# Altium schematic sheet USB_HUB.SchDoc
size 594 x 420 mm; SheetNumber: 14; SheetTotal: 20
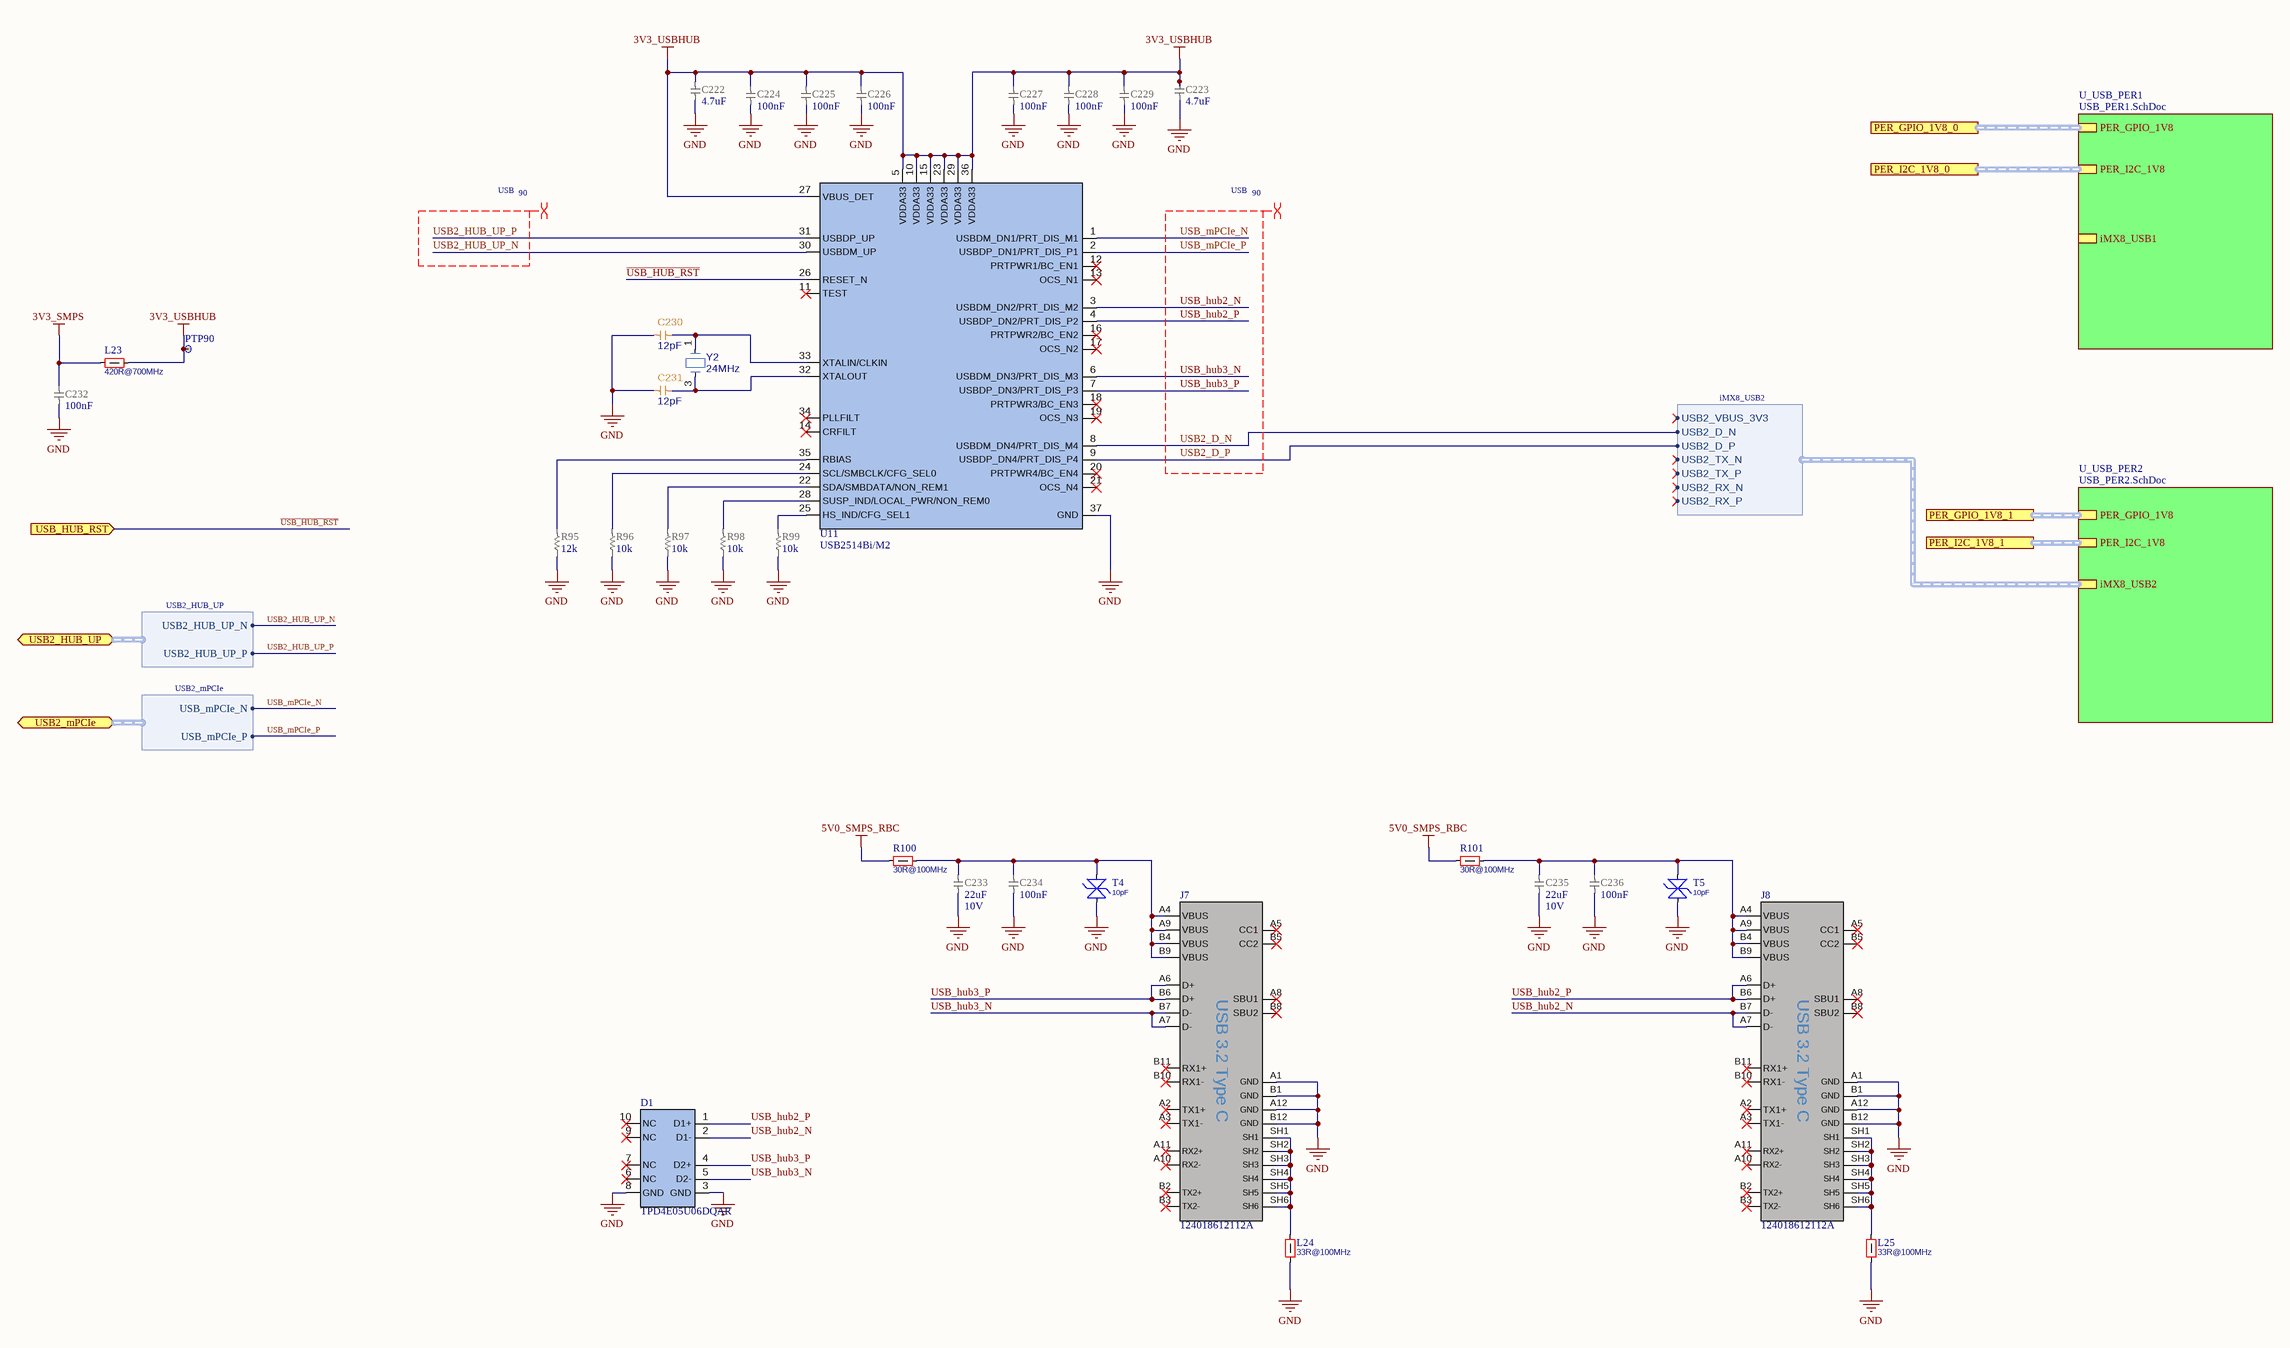
[diagram p0: USB_HUB.SchDoc]

## Parts
C222  value 4.7uF  [CAP_0402_H09W07_UN1Q]  (hidden comment: CAP_0402_4u7_10V_X6S)
C223  value 4.7uF  [CAP_0402_H09W07_UN1Q]  (hidden comment: CAP_0402_4u7_10V_X6S)
C224  value 100nF  [CAP_0201_UN1Q]  (hidden comment: CAP_0201_100n_X7S_16V)
C225  value 100nF  [CAP_0201_UN1Q]  (hidden comment: CAP_0201_100n_X7S_16V)
C226  value 100nF  [CAP_0201_UN1Q]  (hidden comment: CAP_0201_100n_X7S_16V)
C227  value 100nF  [CAP_0201_UN1Q]  (hidden comment: CAP_0201_100n_X7S_16V)
C228  value 100nF  [CAP_0201_UN1Q]  (hidden comment: CAP_0201_100n_X7S_16V)
C229  value 100nF  [CAP_0201_UN1Q]  (hidden comment: CAP_0201_100n_X7S_16V)
C230  value 12pF  [CAP_0201_UN1Q]  (hidden comment: CAP_0201_12pF_RF_MATCHING)
C231  value 12pF  [CAP_0201_UN1Q]  (hidden comment: CAP_0201_12pF_RF_MATCHING)
C232  value 100nF  [CAP_0201_UN1Q]  (hidden comment: CAP_0201_100n_X7S_16V)
C233  value 22uF  Voltage: 10V  [CAP_0805_UN1Q]  (hidden comment: CAP_0805_22uF_10V_X7R)
C234  value 100nF  [CAP_0201_UN1Q]  (hidden comment: CAP_0201_100n_X7S_16V)
C235  value 22uF  Voltage: 10V  [CAP_0805_UN1Q]  (hidden comment: CAP_0805_22uF_10V_X7R)
C236  value 100nF  [CAP_0201_UN1Q]  (hidden comment: CAP_0201_100n_X7S_16V)
D1  TPD4E05U06DQAR  [USON10_DQA_TI]
J7  Part Number: 124018612112A  [USB_C_AMPHENOL_124018612112A]  (hidden comment: USB_C_AMPHENOL_124018612112A)
J8  Part Number: 124018612112A  [USB_C_AMPHENOL_124018612112A]  (hidden comment: USB_C_AMPHENOL_124018612112A)
L23  value 420R@700MHz  [IND_0201_UN1Q]  (hidden comment: FERRITE_0201_BLF_700MHz_420Ohm)
L24  value 33R@100MHz  [IND_0201_UN1Q]  (hidden comment: FERRITE_0201_BLM03_33Ohm)
L25  value 33R@100MHz  [IND_0201_UN1Q]  (hidden comment: FERRITE_0201_BLM03_33Ohm)
PTP90  PTP_0.4mm  [PTP_0.4mm]  (value not drawn)  (no BOM)
R95  value 12k  [RES_0201_UN1Q]  (hidden comment: RES_0201_12k)
R96  value 10k  [RES_0201_UN1Q]  (hidden comment: RES_0201_10k)
R97  value 10k  [RES_0201_UN1Q]  (hidden comment: RES_0201_10k)
R98  value 10k  [RES_0201_UN1Q]  (hidden comment: RES_0201_10k)
R99  value 10k  [RES_0201_UN1Q]  (hidden comment: RES_0201_10k)
R100  value 30R@100MHz  [FERR_BLM15KD]  (hidden comment: FERRITE_0402_BLM15KD)
R101  value 30R@100MHz  [FERR_BLM15KD]  (hidden comment: FERRITE_0402_BLM15KD)
T4  value 10pF  [TVS_0201_EZAEG]  (hidden comment: TVS_0201_10pF)
T5  value 10pF  [TVS_0201_EZAEG]  (hidden comment: TVS_0201_10pF)
U11  Part Number: USB2514Bi/M2  [USB251xB_QFN36P50_600X600X100]  (hidden comment: USB2514Bi_M2)
Y2  value 24MHz  [XTAL_3225_EPSON]  (hidden comment: XTAL_24M_10ppm_9pF_+105C)

## Sub-sheets
U_USB_PER1 = USB_PER1.SchDoc: PER_GPIO_1V8 (harness PER_GPIO_1V8_0), iMX8_USB1 (harness iMX8_USB1), PER_I2C_1V8 (harness PER_I2C_1V8_0)
U_USB_PER2 = USB_PER2.SchDoc: PER_GPIO_1V8 (harness PER_GPIO_1V8_1), PER_I2C_1V8 (harness PER_I2C_1V8_1), iMX8_USB2 (harness iMX8_USB2)

## Ports
PER_GPIO_1V8_0 (harness PER_GPIO_1V8_0), PER_GPIO_1V8_1 (harness PER_GPIO_1V8_1), PER_I2C_1V8_0 (harness PER_GPIO_1V8_0), PER_I2C_1V8_1 (harness PER_GPIO_1V8_1), USB2_HUB_UP (bidir, harness USB2_HUB_UP), USB2_mPCIe (bidir, harness USB2_mPCIe), USB_HUB_RST (in)

## Harnesses
USB2_HUB_UP: USB2_HUB_UP_P, USB2_HUB_UP_N
USB2_mPCIe: USB_mPCIe_N, USB_mPCIe_P
iMX8_USB2: USB2_VBUS_3V3, USB2_D_N, USB2_D_P, USB2_TX_N, USB2_TX_P, USB2_RX_N, USB2_RX_P

## Nets
3V3_SMPS: C232.2 L23.1
3V3_USBHUB: C222.2 C223.2 C224.1 C225.1 C226.1 C227.1 C228.1 C229.1 L23.2 PTP90.1(TP) U11.5(VDDA33) U11.10(VDDA33) U11.15(VDDA33) U11.23(VDDA33) U11.27(VBUS_DET) U11.29(VDDA33) U11.36(VDDA33)
5V0_SMPS_RBC: R100.1 R101.1
GND: C222.1 C223.1 C224.2 C225.2 C226.2 C227.2 C228.2 C229.2 C230.1 C231.1 C232.1 C233.1 C234.1 C235.1 C236.1 D1.3(GND) D1.8(GND) J7.A1(GND) J7.A12(GND) J7.B1(GND) J7.B12(GND) J8.A1(GND) J8.A12(GND) J8.B1(GND) J8.B12(GND) L24.2 L25.2 R95.1 R96.1 R97.1 R98.1 R99.1 T4.1 T5.1 U11.37(GND) Y2.2(GND) Y2.4(GND)
~{USB_HUB_RST}: U11.26(RESET_N) ; port USB_HUB_RST
USB2_D_N: U11.8(USBDM_DN4/PRT_DIS_M4) ; sheet U_USB_PER2/iMX8_USB2.USB2_D_N
USB2_D_P: U11.9(USBDP_DN4/PRT_DIS_P4) ; sheet U_USB_PER2/iMX8_USB2.USB2_D_P
USB2_HUB_UP_N: U11.30(USBDM_UP) ; port USB2_HUB_UP.USB2_HUB_UP_N
USB2_HUB_UP_P: U11.31(USBDP_UP) ; port USB2_HUB_UP.USB2_HUB_UP_P
USB_hub2_N: D1.2(D1-) J8.A7(D-) J8.B7(D-) U11.3(USBDM_DN2/PRT_DIS_M2)
USB_hub2_P: D1.1(D1+) J8.A6(D+) J8.B6(D+) U11.4(USBDP_DN2/PRT_DIS_P2)
USB_hub3_N: D1.5(D2-) J7.A7(D-) J7.B7(D-) U11.6(USBDM_DN3/PRT_DIS_M3)
USB_hub3_P: D1.4(D2+) J7.A6(D+) J7.B6(D+) U11.7(USBDP_DN3/PRT_DIS_P3)
USB_mPCIe_N: U11.1(USBDM_DN1/PRT_DIS_M1) ; port USB2_mPCIe.USB_mPCIe_N
USB_mPCIe_P: U11.2(USBDP_DN1/PRT_DIS_P1) ; port USB2_mPCIe.USB_mPCIe_P
NetC230_2: C230.2 U11.33(XTALIN/CLKIN) Y2.1
NetC231_2: C231.2 U11.32(XTALOUT) Y2.3
NetC233_2: C233.2 C234.2 J7.A4(VBUS) J7.A9(VBUS) J7.B4(VBUS) J7.B9(VBUS) R100.2 T4.2
NetC235_2: C235.2 C236.2 J8.A4(VBUS) J8.A9(VBUS) J8.B4(VBUS) J8.B9(VBUS) R101.2 T5.2
NetJ7_SH1: J7.SH1 J7.SH2 J7.SH3 J7.SH4 J7.SH5 J7.SH6 L24.1
NetJ8_SH1: J8.SH1 J8.SH2 J8.SH3 J8.SH4 J8.SH5 J8.SH6 L25.1
NetR95_2: R95.2 U11.35(RBIAS)
NetR96_2: R96.2 U11.24(SCL/SMBCLK/CFG_SEL0)
NetR97_2: R97.2 U11.22(SDA/SMBDATA/NON_REM1)
NetR98_2: R98.2 U11.28(SUSP_IND/LOCAL_PWR/NON_REM0)
NetR99_2: R99.2 U11.25(HS_IND/CFG_SEL1)

Not connected (* = marked no-connect by the designer): D1 6(NC)* 7(NC)* 9(NC)* 10(NC)*; J7 A2(TX1+)* A3(TX1-)* A5(CC1)* A8(SBU1)* A10(RX2-)* A11(RX2+)* B2(TX2+)* B3(TX2-)* B5(CC2)* B8(SBU2)* B10(RX1-)* B11(RX1+)*; J8 A2(TX1+)* A3(TX1-)* A5(CC1)* A8(SBU1)* A10(RX2-)* A11(RX2+)* B2(TX2+)* B3(TX2-)* B5(CC2)* B8(SBU2)* B10(RX1-)* B11(RX1+)*; U11 11(TEST)* 12(PRTPWR1/BC_EN1)* 13(OCS_N1)* 14(CRFILT)* 16(PRTPWR2/BC_EN2)* 17(OCS_N2)* 18(PRTPWR3/BC_EN3)* 19(OCS_N3)* 20(PRTPWR4/BC_EN4)* 21(OCS_N4)* 34(PLLFILT)*

## Buses and harness runs
harness port PER_GPIO_1V8_0 = sheet U_USB_PER1/PER_GPIO_1V8
harness port PER_GPIO_1V8_1 = sheet U_USB_PER2/PER_GPIO_1V8
harness port PER_I2C_1V8_0 = sheet U_USB_PER1/PER_I2C_1V8
harness port PER_I2C_1V8_1 = sheet U_USB_PER2/PER_I2C_1V8

## Layout directives
differential pair; differential pair class 90; net class USB; rule Matched Net Lengths [Tolerance = 0.3mm]: USB2_D_N, USB2_D_P, USB2_HUB_UP_N, USB2_HUB_UP_P, USB_hub2_N, USB_hub2_P, USB_hub3_N, USB_hub3_P, USB_mPCIe_N, USB_mPCIe_P

## Notes on the sheet
- DWG NO:
- REV:
- THIS DOCUMENT AND THE DATA DISCLOSED HEREIN OR
- HEREWITH IS THE PROPERTY OF ALTIUM LIMITED AND MAY
- BE FREELY DISTRIBUTED IN WHOLE. NO RIGHTS ARE
- RESERVED OR EXPRESS OR IMPLIED WARANTEE GIVEN.
- REVISION
- DESCRIPTION
- DATE
- APPROVED
- ENG:
- APPROVALS
- PROJECT
- DSN:
- CHK:
- REFERENCE DOCUMENTS
- PROJECT REVISION:
- TITLE
- DOCUMENT REVISION:
- DESIGN ITEM:
- BOM:
- FAB DWG:
- PCB DWG:
- ASSY DWG:
- SCALE:
- A2
- SIZE
- CAGE CODE
- FILE NAME
- DWG NO.
- SHEET
- OF
- REV
- (in symbol CMP-001-001438-8) USB 3.2 Type C

## Library data of the parts
C222 C223 = CMP-001-000888-12: CAP; Part Number: GRT155C81A475ME13J; Manufacturer: Murata; Sort order: 304; HasBeenBuilt: TBD; Alternative component: Allowed; System: RLC; Voltage: 10V; Temperature characteristics: X6S; Tolerance: +/-10%; ComponentLink2Description: 2_Product page; Package: 0402; Creation date: 26042024; ComponentLink1Description: 1_Datasheet; ComponentLink3Description: 3_X-information; ComponentLink4Description: 4_X-information; Manufacturer Part Number: GRT155C81A475ME13J; Component Type: Capacitor
C224-C229 C232 C234 C236 = CMP-001-000385-16: CAP; Part Number: GRM033C71C104KE14D; Manufacturer: Murata; Temperature characteristics: X7S; Tolerance: +/-10%; Sort order: 302; HasBeenBuilt: TBD; Alternative component: Allowed; Voltage: 16V; System: RLC; Package: 0201; ClassName: SMALL; ComponentLink1Description: 1_Datasheet; ComponentLink2Description: 2_Product page; ComponentLink3Description: 3_X-information; ComponentLink4Description: 4_X-information; Creation date: 20190101; Source: RLC_UN1Q.SchLib; Manufacturer Part Number: GRM033C71C104KE14D; Component Type: Capacitor
C230 C231 = CMP-001-000420-11: CAP_RF_MATCHING; Part Number: GRM0335C1H120GA01; Manufacturer: Murata; Voltage: 50V; Tolerance: +/- 2%; Temperature characteristics: C0G; Remark: RF matching, use part number; Sort order: 202; HasBeenBuilt: TBD; System: RLC; Package: 0201; Operating temperature range: -55 ... +125C; ComponentLink1Description: 1_Datasheet; ComponentLink2Description: 2_Product page; ComponentLink3Description: 3_X-information; ComponentLink4Description: 4_X-information; Creation date: 20211123; ClassName: SMALL; Source: RLC_UN1Q.SchLib; Manufacturer Part Number: GRM0335C1H120GA01; Component Type: Capacitor
C233 C235 = CMP-001-000892-11: CAP; Part Number: GRM21BZ71A226ME15L; Manufacturer: Murata; Tolerance: +/-20%; Alternative component: Allowed; Sort order: 308; Temperature characteristics: X7R; System: RLC; HasBeenBuilt: TBD; Creation date: 22032024; ComponentLink4Description: 4_X-information; ComponentLink1Description: 1_Datasheet; ComponentLink3Description: 3_X-information; ComponentLink2Description: 2_Product page; Package: 0805; Manufacturer Part Number: GRM21BZ71A226ME15L; Component Type: Capacitor
D1 = CMP-001-000916-4: 4-CH Low-Capacitance ESD Diode; Manufacturer: Texas Instruments; HasBeenBuilt: Saluki3_HW_RIB_2; Sort order: 405; System: IC; ComponentLink1Description: 1_Datasheet; ComponentLink1URL: http://www.ti.com/lit/gpn/tpd4e05u06; ComponentLink2Description: 2_Product page; ComponentLink2URL: https://www.ti.com/product/TPD4E05U06; ComponentLink3Description: 3_X-information; ComponentLink4Description: 4_X-information; Creation date: 20210927; Dimensions WxLxH: 2.5x1.0x0.55; Operating temperature range: -40... +125 °C; Package: USON10; Part Number: TPD4E05U06DQAR; ECCN: EAR99; RoHS: RoHS3; Source: UUDET_KOMPONENTIT.SchLib; Manufacturer Part Number: TPD4E05U06DQAR; Component Type: ESD & EMI
J7 J8 = CMP-001-001438-8: USB3.2 GEN1, Type C, Top mount, CH 1.50mm, Dual Row SMT, IPX8; Manufacturer Part Number: 12402082E512A; Sort order: 101; System: Connector; ClassName: BIG; ComponentLink1Description: 1_Datasheet; ComponentLink1URL: https://cdn.amphenol-cs.com/media/wysiwyg/files/documentation/datasheet/inputoutput/io_usb_type_c.pdf; ComponentLink2Description: 2_Product page; ComponentLink2URL: https://www.amphenol-cs.com/product/124018612112a.html; ComponentLink3Description: 3_X-information; ComponentLink4Description: 4_X-information; Operating temperature range: -40C to +85C; Creation date: 20250617; Manufacturer: Amphenol; ECCN: EAR99; Design Item ID: USB_C_AMPHENOL_124018612112A; RoHS: RoHS 3; Component Type: Interface Connector
L23 = CMP-001-000747-7: FERRITE; Part Number: BLF03JD421GZE; Manufacturer: Murata; HasBeenBuilt: False; System: Discrete; Sort order: 362; Tolerance: 25%; ComponentLink3Description: 3_X-information; Creation date: 20200304; ClassName: SMALL; ComponentLink1Description: 1_Datasheet; ComponentLink2Description: 2_Product page; Package: 0201; ComponentLink4Description: 4_X-information; Source: Discrete_UN1Q.SchLib; Operating temperature range: -55 ... +125C; Manufacturer Part Number: BLF03JD421GZE; Component Type: Ferrite
L24 L25 = CMP-001-000744-7: FERRITE; Manufacturer: Murata; Part Number: BLM03PG330SN1; Tolerance: 25%; Sort order: 362; HasBeenBuilt: TBD; System: Discrete; Package: 0201; Operating temperature range: -55 ... +125C; ClassName: SMALL; ComponentLink1Description: 1_Datasheet; ComponentLink1URL: https://www.murata.com/en-us/products/productdetail.aspx?cate=luNoiseSupprFilteChipFerriBead&partno=BLM03PG330SN1%23; ComponentLink2Description: 2_Product page; ComponentLink3Description: 3_X-information; ComponentLink4Description: 4_X-information; Creation date: 20200304; Source: Discrete_UN1Q.SchLib; Manufacturer Part Number: BLM03PG330SN1; Component Type: Ferrite
PTP90 = CMP-001-001296-3: Production Testpoint 0.4mm. Flying probe. Use 1mm pitch.; ComponentLink4Description: 4_X-information; ComponentLink1Description: 1_Datasheet; Part Number: PTP 0.4mm; Sort order: -; ClassName: SMALL; System: Test Point; HasBeenBuilt: -; Design Item ID: PTP_0.4mm; ComponentLink3Description: 3_X-information; Creation date: 20240909; ComponentLink2Description: 2_Product page
R95 = CMP-001-000450-13: RES; Part Number: RC0201FR-0712KL; Manufacturer: YAGEO; Power Rating: 1/20W; Alternative component: Allowed; Tolerance: 1%; System: RLC; Sort order: 322; HasBeenBuilt: TBD; Package: 0201; ComponentLink4Description: 4_X-information; ComponentLink1Description: 1_Datasheet; Creation date: 20190101; Source: RLC_UN1Q.SchLib; ComponentLink2Description: 2_Product page; ClassName: SMALL; ComponentLink3Description: 3_X-information; Component Type: Resistor
R96-R99 = CMP-001-000446-13: RES; Part Number: RC0201FR-0710KL; Manufacturer: YAGEO; Power Rating: 1/20W; Sort order: 322; HasBeenBuilt: TBD; Tolerance: 1%; Alternative component: Allowed; System: RLC; Package: 0201; ClassName: SMALL; ComponentLink1Description: 1_Datasheet; ComponentLink2Description: 2_Product page; ComponentLink3Description: 3_X-information; ComponentLink4Description: 4_X-information; Creation date: 20190101; Source: RLC_UN1Q.SchLib; Component Type: Resistor
R100 R101 = CMP-001-000738-12: FERRITE; Part Number: BLM15KD300SN1; Manufacturer: Murata; Manufacturer Part Number: BLM15KD300SN1D; Sort order: 364; HasBeenBuilt: Saluki2; System: Discrete; Current: 3.1A; Package: 0402; Operating temperature range: -55 ... +125C; Dimensions WxLxH: 0.55mm; ComponentLink1Description: 1_Datasheet; ComponentLink1URL: https://www.murata.com/en-us/products/productdetail.aspx?cate=luNoiseSupprFilteChipFerriBead&partno=BLM15KD300SN1%23; ComponentLink2Description: 2_Product page; ComponentLink3Description: 3_X-information; ComponentLink4Description: 4_X-information; Creation date: 20200304; Source: Discrete_UN1Q.SchLib; ECCN: EAR99; RoHS: RoHS3; Component Type: Ferrite
T4 T5 = CMP-001-000756-6: ESD Protection  TVS Diodes SMP Diode 0201 5vdc 10 pf <8v clamp@1a; Part Number: GG020105100N2P; Manufacturer: TDK; Voltage: 5.5V; Sort order: 402; HasBeenBuilt: TBD; System: Discrete; Package: 0201; Operating temperature range: -40 ... +85C; Dimensions WxLxH: tbd; ComponentLink1Description: 1_Datasheet; ComponentLink1URL: https://www2.mouser.com/datasheet/2/40/AVX_GiGuard-1101674.pdf; ComponentLink2Description: 2_Product page; ComponentLink3Description: 3_X-information; ComponentLink4Description: 4_X-information; Creation date: 20211207; ClassName: SMALL; Source: Discrete_UN1Q.SchLib; Manufacturer Part Number: GG020105100N2P; Component Type: ESD & EMI
U11 = CMP-076-000057-8: USB 2.0 Hi-Speed Hub Controller; Manufacturer: Microchip; HasBeenBuilt: SleeveIO_01; Sort order: 501; System: IC; ClassName: BIG; ComponentLink1Description: 1_Datasheet; ComponentLink1URL: http://www.microchip.com/mymicrochip/filehandler.aspx?ddocname=en562310; ComponentLink2Description: 2_Product page; ComponentLink2URL: https://www.microchip.com/en-us/product/USB2513B; Creation Date: 20211026; Dimensions WxLxH: 6x6x1; Operating temperature range: -40 ... +85 °C; Package: SQFN36; Source: IC_UN1Q.SchLib; Design Item ID: USB2514Bi_M2; ComponentLink3Description: 3_X-information; ComponentLink4Description: 4_X-information; Manufacturer Part Number: USB2514Bi/M2; Component Type: Data Converter
Y2 = CMP-001-001243-5: Crystal 24 MHz ±10ppm 9pF 40Ohms 4-SMD; Part Number: TSX-3225 24.0000MF20G-AC3; Manufacturer: EPSON; Tolerance: +/-10ppm; Sort order: 455; System: Discrete; Operating temperature range: -40 ... +105C; Dimensions WxLxH: 3.2 x 2.5 x 0.6mm; ComponentLink1Description: 1_Datasheet; ComponentLink1URL: https://support.epson.biz/td/api/doc_check.php?dl=brief_TSX-3225&lang=en; ComponentLink2Description: 2_Product page; ComponentLink3Description: 3_X-information; ComponentLink4Description: 4_X-information; Creation date: 20240430; Manufacturer: Epson; Manufacturer Part Number: TSX-3225 24.0000MF20G-AC3; Component Type: Crystal & Oscillator